# EAGLE design nazoru-stack (EAGLE 8.7.0)
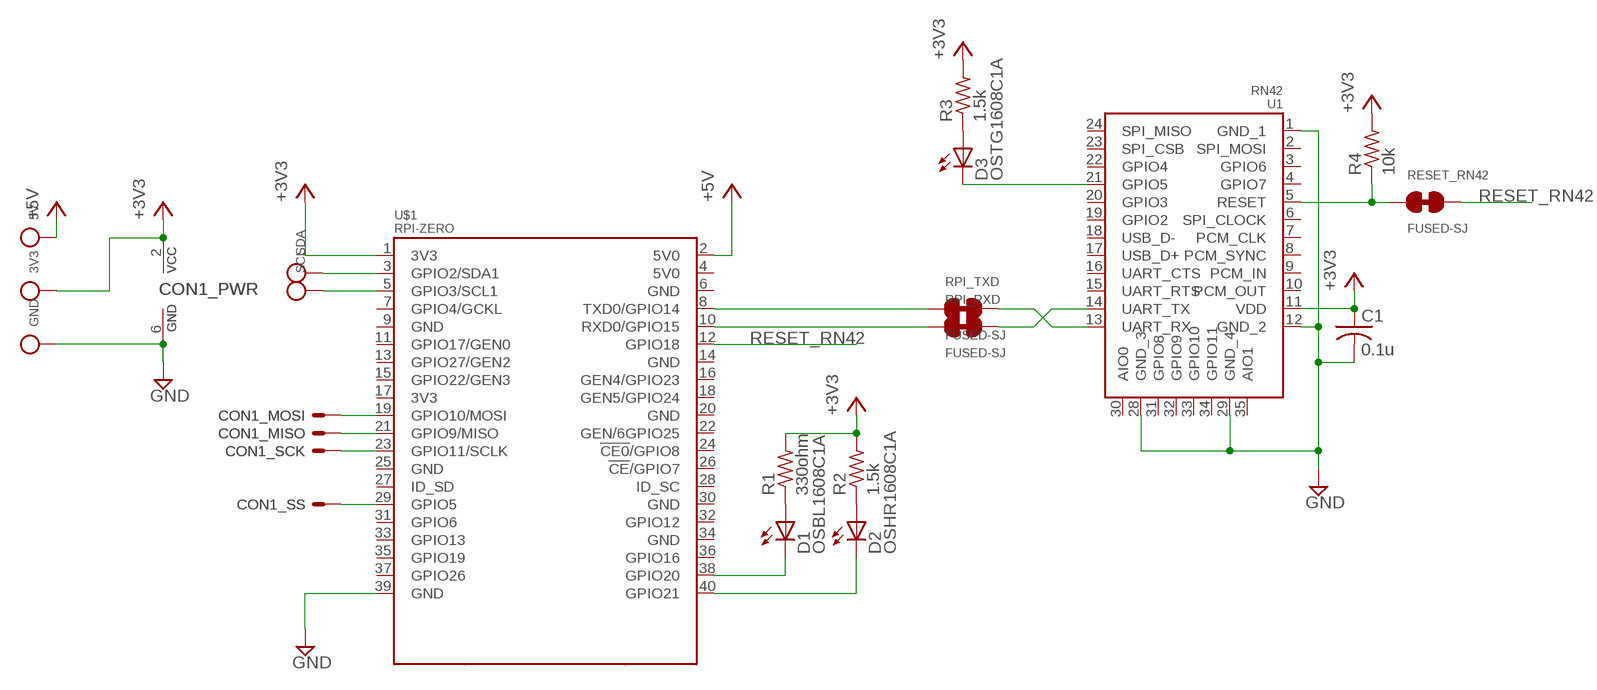
[diagram p0: schematic, sheet 1]

## Parts
3V3  CHECK_PIN  [SLC-22-G]
5V  CHECK_PIN  [SLC-22-G]
C1  0.1u  C-2012  [2012-C]
CON1  SPI  [ML6]
D1  OSBL1608C1A  [1608-LED]
D2  OSHR1608C1A  [1608-LED]
D3  OSTG1608C1A  [1608-LED]
GND  CHECK_PIN  [SLC-22-G]
R1  330ohm  R-1608  [1608]
R2  1.5k  R-1608  [1608]
R3  1.5k  R-1608  [1608]
R4  10k  R-1608  [1608]
RESET_RN42  FUSED-SJ  [FUSED-SJ]
RPI_RXD  FUSED-SJ  [FUSED-SJ]
RPI_TXD  FUSED-SJ  [FUSED-SJ]
SCL  CHECK_PIN  [SLC-22-G]
SDA  CHECK_PIN  [SLC-22-G]
U1  RN42  [RN42]
U$1  RPI-ZERO  [RPI-ZERO]

## Nets
+3V3: 3V3.SIGNAL C1.1 CON1.2(_PWR:VCC) R1.2 R2.2 R3.2 R4.2 U1.11(VDD) U$1.1(3V3)
+5V: 5V.SIGNAL U$1.2(5V0)
GND: C1.2 CON1.6(_PWR:GND) GND.SIGNAL U1.1(GND_1) U1.12(GND_2) U1.28(GND_3) U1.29(GND_4) U$1.39(GND)
N$1: D1.1(A) R1.1
N$2: RPI_TXD.1 U$1.8(TXD0/GPIO14)
N$3: RPI_RXD.1 U$1.10(RXD0/GPIO15)
N$4: RPI_TXD.2 U1.13(UART_RX)
N$5: RPI_RXD.2 U1.14(UART_TX)
N$6: D1.2(K) U$1.38(GPIO20)
N$7: D2.2(K) U$1.40(GPIO21)
N$8: D2.1(A) R2.1
N$9: D3.1(A) R3.1
N$10: D3.2(K) U1.21(GPIO5)
N$11: R4.1 RESET_RN42.1 U1.5(RESET)
N$12: CON1.4(_MOSI:S) U$1.19(GPIO10/MOSI)
N$13: CON1.1(_MISO:S) U$1.21(GPIO9/MISO)
N$14: CON1.3(_SCK:S) U$1.23(GPIO11/SCLK)
N$15: CON1.5(_SS:S) U$1.29(GPIO5)
N$16: SDA.SIGNAL U$1.3(GPIO2/SDA1)
N$17: SCL.SIGNAL U$1.5(GPIO3/SCL1)
RESET_RN42: RESET_RN42.2 U$1.12(GPIO18)
Unconnected: U1.2(SPI_MOSI) U1.3(GPIO6) U1.4(GPIO7) U1.6(SPI_CLOCK) U1.7(PCM_CLK) U1.8(PCM_SYNC) U1.9(PCM_IN) U1.10(PCM_OUT) U1.15(UART_RTS) U1.16(UART_CTS) U1.17(USB_D+) U1.18(USB_D-) U1.19(GPIO2) U1.20(GPIO3) U1.22(GPIO4) U1.23(SPI_CSB) U1.24(SPI_MISO) U1.30(AIO0) U1.31(GPIO8) U1.32(GPIO9) U1.33(GPIO10) U1.34(GPIO11) U1.35(AIO1) U$1.4(5V0) U$1.6(GND) U$1.7(GPIO4/GCKL) U$1.9(GND) U$1.11(GPIO17/GEN0) U$1.13(GPIO27/GEN2) U$1.14(GND) U$1.15(GPIO22/GEN3) U$1.16(GEN4/GPIO23) U$1.17(3V3) U$1.18(GEN5/GPIO24) U$1.20(GND) U$1.22(GEN/6GPIO25) U$1.24(!CE0!/GPIO8) U$1.25(GND) U$1.26(!CE!/GPIO7) U$1.27(ID_SD) U$1.28(ID_SC) U$1.30(GND) U$1.31(GPIO6) U$1.32(GPIO12) U$1.33(GPIO13) U$1.34(GND) U$1.35(GPIO19) U$1.36(GPIO16) U$1.37(GPIO26)

## Library data of the parts
3V3 5V GND SCL SDA = mylibrary:CHECK_PIN
C1 = mylibrary:C
CON1 = mylibrary:SPI: SPI interface. 1: MISO 2: VCC 3: SCK 4: MOSI 5: SS 6: GND
D1 = mylibrary:OS*1608C1A: OSXX1608C1A Features: 1.6mm x 0.8mm x 0.6mm Vf @ 5mA Datasheet is avaliable here <http://akizukidenshi.com/download/ds/optosupply/OSXX1608C1A_ver_a_10.pdf>; AKIZUKI: Yes; COLOR: Blue; VF: 2.9
D2 = mylibrary:OS*1608C1A: OSXX1608C1A Features: 1.6mm x 0.8mm x 0.6mm Vf @ 5mA Datasheet is avaliable here <http://akizukidenshi.com/download/ds/optosupply/OSXX1608C1A_ver_a_10.pdf>; AKIZUKI: Yes; COLOR: Red; VF: 1.9
D3 = mylibrary:OS*1608C1A: OSXX1608C1A Features: 1.6mm x 0.8mm x 0.6mm Vf @ 5mA Datasheet is avaliable here <http://akizukidenshi.com/download/ds/optosupply/OSXX1608C1A_ver_a_10.pdf>; AKIZUKI: Yes; COLOR: True green; VF: 2.9
R1-R4 = mylibrary:R
RESET_RN42 RPI_RXD RPI_TXD = mylibrary:FUSED-SJ
U1 = mylibrary:RN42: Bluetooth module RN-42-I/RM by akizuki [link <http://akizukidenshi.com/catalog/g/gM-07612/>]
U$1 = mylibrary:RPI-ZERO

## Board
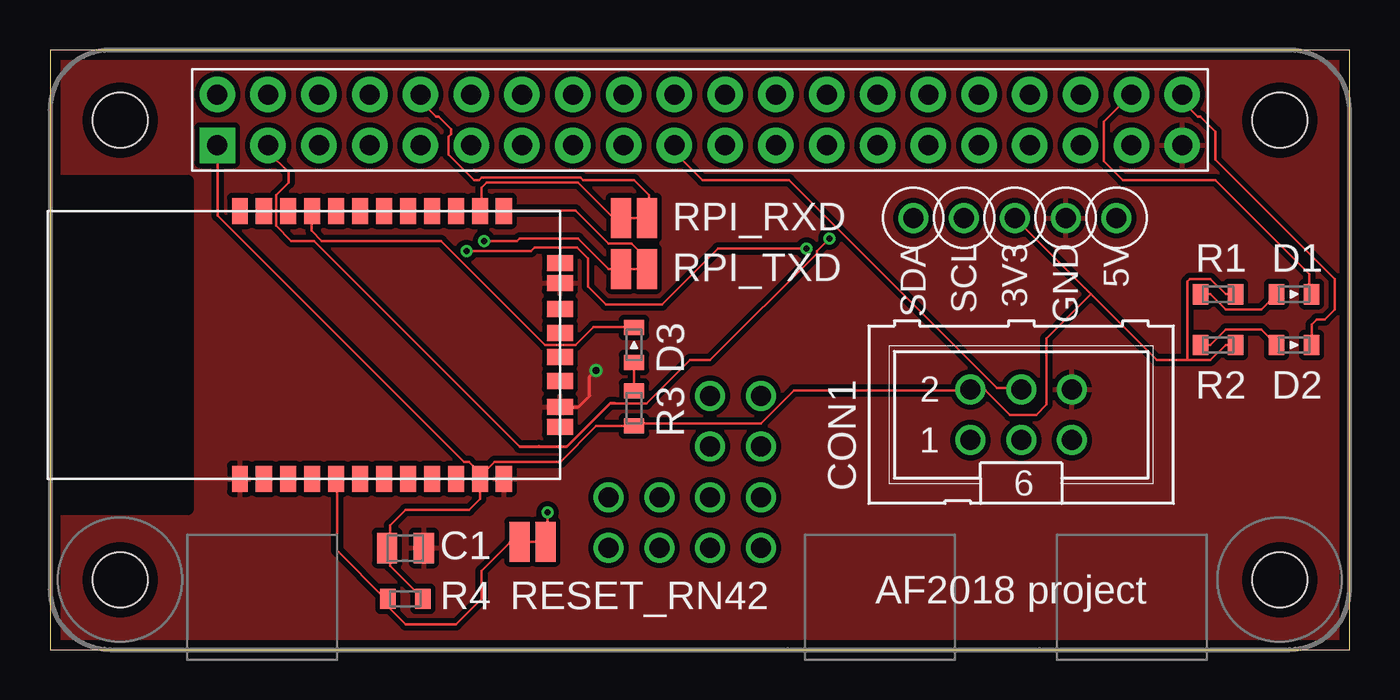
[diagram p1: board, top side]
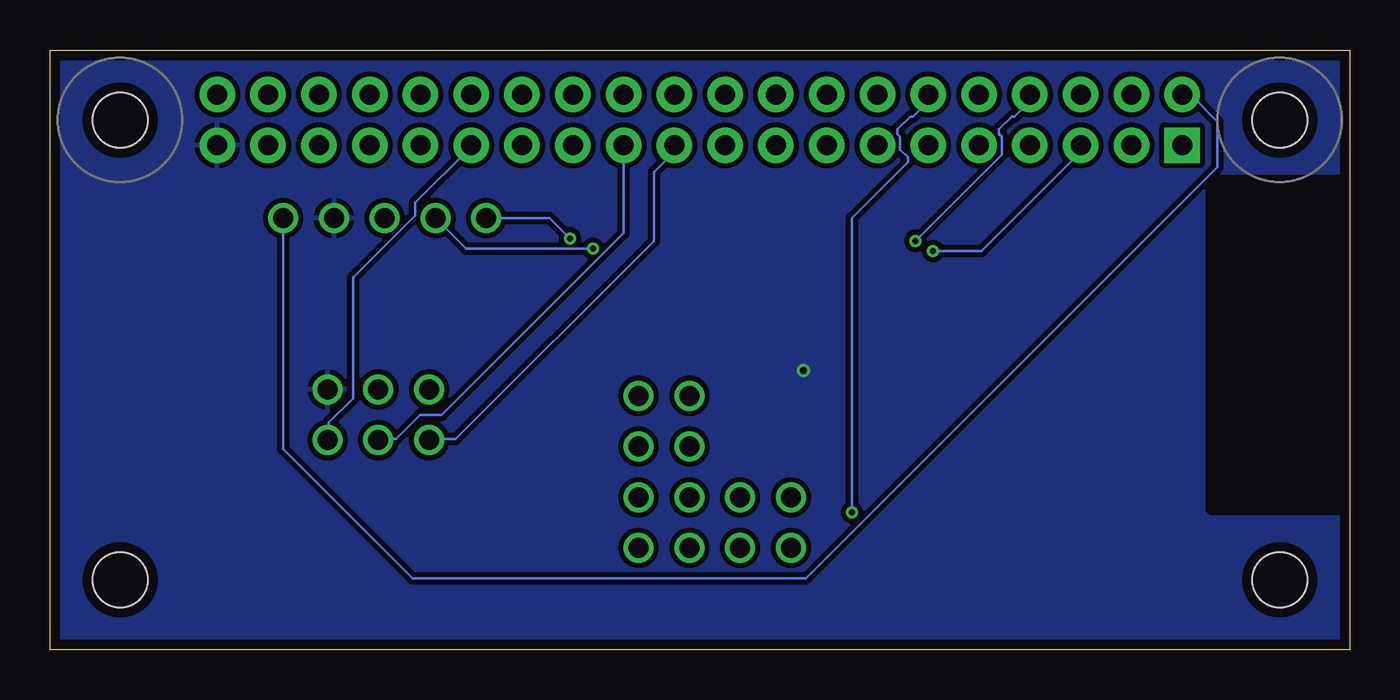
[diagram p2: board, bottom side, seen from below]

Size 65 x 30 mm. Coordinates in mm from the lower left corner, seen from the top.
Outline: 0,0 65,0 65,30 0,30 0,0
Copper layers (1*16): Top 0.035mm / dielectric 1.5mm / Bottom 0.035mm
Design rules "p_ban_2layer": minimum track width 5mil, minimum drill 0.3mm, track to track 5mil, track to pad 5mil, pad to pad 5mil, via to via 5mil, smd to smd 5mil, copper to edge 0.5mm, drill to drill 0.3mm, minimum pad ring 0.15mm, minimum via ring 0.15mm, stop-mask expansion 4mil, vias tented up to drill 0.35mm, thermal gap 10mil

### Footprints (pad centres in the part's own frame; a part is rotated, then mirrored left to right if it is on the bottom)
SLC-22-G = drill 1: SIGNAL 0,0
2012-C = smd 1.016 x 1.524: 1 -0.921,0; 2 0.921,0
ML6 = drill 1: 1 -2.54,-1.27; 2 -2.54,1.27; 3 0,-1.27; 4 0,1.27; 5 2.54,-1.27; 6 2.54,1.27
1608-LED = smd 0.762 x 1.016: 1 -0.875,0; 2 0.875,0
1608 = smd 0.762 x 1.016: 1 -0.875,0; 2 0.875,0
FUSED-SJ = smd 1 x 2: 1 -0.65,0; 2 0.65,0
RN42 = smd 1.3 x 0.8: 1 -6.7,3.2; 2 -6.7,2; 3 -6.7,0.8; 4 -6.7,-0.4; 5 -6.7,-1.6; 6 -6.7,-2.8; 7 -6.7,-4; 8 -6.7,-5.2; 9 -6.7,-6.4; 10 -6.7,-7.6; 11 -6.7,-8.8; 12 -6.7,-10; 13 6.7,-10; 14 6.7,-8.8; 15 6.7,-7.6; 16 6.7,-6.4; 17 6.7,-5.2; 18 6.7,-4; 19 6.7,-2.8; 20 6.7,-1.6; 21 6.7,-0.4; 22 6.7,0.8; 23 6.7,2; 24 6.7,3.2 | smd 0.8 x 1.3: 28 3.1,-12.8; 29 -3.1,-12.8; 30 4.1,-12.8; 31 1.8,-12.8; 32 0.6,-12.8; 33 -0.6,-12.8; 34 -1.8,-12.8; 35 -4.1,-12.8
RPI-ZERO = drill 1 pad 1.778 square: 1 8.37,25.23 | drill 1 pad 1.778: 2 8.37,27.77; 3 10.91,25.23; 4 10.91,27.77; 5 13.45,25.23; 6 13.45,27.77; 7 15.99,25.23; 8 15.99,27.77; 9 18.53,25.23; 10 18.53,27.77; 11 21.07,25.23; 12 21.07,27.77; 13 23.61,25.23; 14 23.61,27.77; 15 26.15,25.23; 16 26.15,27.77; 17 28.69,25.23; 18 28.69,27.77; 19 31.23,25.23; 20 31.23,27.77; 21 33.77,25.23; 22 33.77,27.77; 23 36.31,25.23; 24 36.31,27.77; 25 38.85,25.23; 26 38.85,27.77; 27 41.39,25.23; 28 41.39,27.77; 29 43.93,25.23; 30 43.93,27.77; 31 46.47,25.23; 32 46.47,27.77; 33 49.01,25.23; 34 49.01,27.77; 35 51.55,25.23; 36 51.55,27.77; 37 54.09,25.23; 38 54.09,27.77; 39 56.63,25.23; 40 56.63,27.77 | hole 2.75: 3.5,3.5; 3.5,26.5; 61.5,3.5; 61.5,26.5

### Placement (x,y rotation side)
3V3  48.26,21.59 0 top
5V  53.34,21.59 0 top
C1  17.78,5.08 0 top
CON1  48.58,11.75 0 top
D1  62.23,17.78 0 top
D2  62.23,15.24 0 top
D3  29.21,15.24 90 top
GND  50.8,21.59 0 top
R1  58.42,17.78 0 top
R2  58.42,15.24 0 top
R3  29.21,12.06 270 top
R4  17.78,2.54 0 top
RESET_RN42  24.13,5.4 0 top
RPI_RXD  29.21,21.59 180 top
RPI_TXD  29.21,19.05 0 top
SCL  45.72,21.59 0 top
SDA  43.18,21.59 0 top
U1  12.7,15.24 90 top
U$1  0,0 0 top

### Tracks (layer width: path | path; a pad name or v marks a point on that pad's centre or on a via)
+3V3
  Top 0.127: 21.59,8.76 21.46,8.64 U1.11 21.5,7.53 20.95,6.99 17.78,6.99 17,6.21 17,4.94 | 21.59,8.76 22.23,9.4 25.53,9.4 27.3,11.18 29.21,11.18 R3.2 29.21,11.3 35.56,11.3 37.21,12.95 45.97,12.95 CON1.2 46.1,12.95 46.8,12.95 48.01,11.75 49.34,11.75 49.85,12.26 49.85,15.56 52.07,17.78 | 21.59,8.76 20.95,9.4 20.7,9.4 8.38,21.72 8.38,25.15 U$1.1 | 17,4.94 17.02,4.92 17.02,4.19 R4.2 | 17,4.94 C1.1 | R2.2 58.8,15.24 58.04,14.48 56.9,14.48 | 56.9,14.48 55.37,14.48 52.07,17.78 | R1.2 58.8,17.78 58.04,18.54 57.02,18.54 56.9,18.41 56.9,14.48 | 3V3.SIGNAL 52.07,17.78
+5V
  Bottom 0.127: U$1.2 8.26,27.69 7.87,27.69 6.6,26.42 6.6,24.13 27.18,3.56 46.86,3.56 53.34,10.03 5V.SIGNAL
GND  (via drill 0.35)
  Top 0.152: U1.29 26.43,12.14 26.99,12.7 26.99,13.65 v27.3,13.97
  pour Top (isolate 0.254): 0,30 65,30 65,0 0,0
  pour Bottom (isolate 0.254): 0,30 65,30 65,0 0,0
N$1
  Top 0.127: R1.1 58.04,17.78 58.8,17.02 60.58,17.02 D1.1
N$2  (via drill 0.3)
  Top 0.127: RPI_TXD.1 27.94,19.05 26.42,20.57 23.5,20.57 23.37,20.45 v21.72,20.45
  Bottom 0.127: v21.72,20.45 17.4,24.77 17.4,25.65 17.53,25.78 17.53,26.04 16.89,26.67 16.76,26.67 16,27.43 16,27.69 U$1.8
N$3
  Top 0.127: RPI_RXD.1 29.97,21.59 29.97,22.73 29.21,23.5 26.67,23.5 26.54,23.62 21.59,23.62 21.46,23.5 21.21,23.5 19.94,24.77 19.94,25.65 20.07,25.78 20.07,26.04 19.43,26.67 19.3,26.67 18.54,27.43 18.54,27.69 U$1.10
N$4
  Top 0.127: U1.13 22.73,21.97 26.29,21.97 27.94,20.32 29.08,20.32 29.97,19.43 29.97,19.05 RPI_TXD.2
N$5
  Top 0.127: RPI_RXD.2 28.19,21.59 26.42,23.37 21.84,23.37 21.59,23.11 21.59,21.97 U1.14
N$6
  Top 0.127: D1.2 62.99,17.78 62.99,18.8 58.29,23.5 53.66,23.5 52.7,24.45 52.7,26.42 53.98,27.69 U$1.38
N$7
  Top 0.127: D2.2 63.12,15.24 63.12,16.26 63.37,16.51 63.75,16.51 64.26,17.02 64.26,18.54 58.29,24.51 58.29,25.91 57.53,26.67 57.4,26.67 56.64,27.43 56.64,27.69 U$1.40
N$8
  Top 0.127: R2.1 58.04,15.24 58.8,16 60.58,16 D2.1
N$9
  Top 0.127: D3.1 R3.1
N$10
  Top 0.127: D3.2 27.18,16.13 26.29,15.24 24.77,15.24 19.56,20.45 13.59,20.45 13.08,20.95 13.08,21.84 U1.21
N$11
  Top 0.127: U1.5 14.35,8.51 14.35,4.95 16.76,2.54 R4.1 16.91,2.15 17.78,1.27 20.32,1.27 21.59,2.54 21.59,3.94 22.99,5.33 23.37,5.33 RESET_RN42.1
N$12
  Top 0.127: CON1.4 48.51,13.08 47.37,13.08 36.96,23.5 32.64,23.5 31.24,24.89 31.24,25.15 U$1.19
N$13
  Bottom 0.127: CON1.1 45.97,10.54 44.7,10.54 34.8,20.45 34.8,23.88 33.78,24.89 33.78,25.15 U$1.21
N$14
  Bottom 0.127: CON1.3 48.51,10.54 47.69,10.54 46.48,11.75 45.4,11.75 36.32,20.83 36.32,25.15 U$1.23
N$15
  Bottom 0.127: CON1.5 51.05,10.54 51.05,11.37 49.85,12.57 49.85,18.61 46.74,21.72 46.74,22.35 43.94,25.15 U$1.29
N$16  (via drill 0.3)
  Top 0.127: v38.99,20.57 38.35,19.94 38.35,19.81 33.02,14.48 32,14.48 29.84,12.32 28.26,12.32 28.19,12.32 | 23.5,10.16 13.21,20.45 12.06,20.45 11.3,21.21 11.3,22.73 11.94,23.37 11.94,23.88 10.92,24.89 10.92,25.15 U$1.3
  Top 0.152: 28.26,12.32 28.02,12.32 25.87,10.17 24.45,10.17 24.43,10.16 23.5,10.16
  Bottom 0.127: SDA.SIGNAL 40.01,21.59 v38.99,20.57
N$17  (via drill 0.3)
  Top 0.127: v37.85,20.07 33.4,20.07 30.61,17.27 27.81,17.27 26.92,18.16 26.92,19.56 26.36,20.12 24.23,20.12 24.05,19.94 v20.83,19.94
  Bottom 0.127: SCL.SIGNAL 44.2,20.07 v37.85,20.07 | v20.83,19.94 18.41,19.94 13.46,24.89 13.46,25.15 U$1.5
N$18  (via drill 1)
  other vias: 27.94,5.08
N$19  (via drill 1)
  other vias: 30.48,5.08
N$20  (via drill 1)
  other vias: 30.48,7.62
N$21  (via drill 1)
  other vias: 27.94,7.62
N$22  (via drill 1)
  other vias: 33.02,7.62
N$23  (via drill 1)
  other vias: 33.02,5.08
N$24  (via drill 1)
  other vias: 35.56,5.08
N$25  (via drill 1)
  other vias: 35.56,7.62
N$26  (via drill 1)
  other vias: 35.56,10.16
N$27  (via drill 1)
  other vias: 33.02,10.16
N$28  (via drill 1)
  other vias: 33.02,12.7
N$29  (via drill 1)
  other vias: 35.56,12.7
RESET_RN42  (via drill 0.3)
  Top 0.127: v24.89,6.86 24.89,5.46 RESET_RN42.2
  Bottom 0.127: v24.89,6.86 24.89,21.59 22.1,24.38 22.1,24.64 22.48,25.02 22.48,25.65 22.61,25.78 22.61,26.04 21.97,26.67 21.84,26.67 21.08,27.43 21.08,27.69 U$1.12

### Text on the board
tPlace: AF2018 project